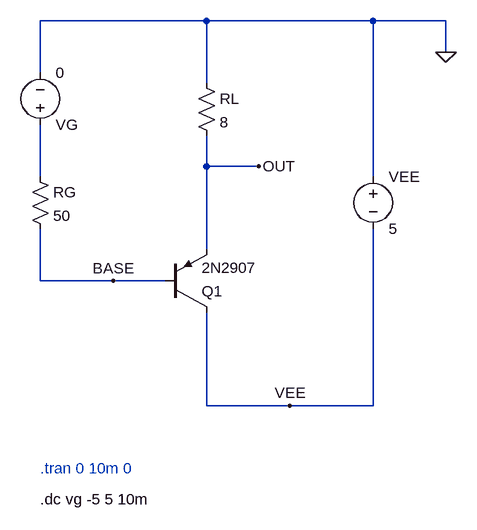
[diagram p0: schematic PNP_Emitter_Follower.asc]
PNP_Emitter_Follower.asc, the LTspice schematic file:
Version 4.1
SHEET 1 1932 1136
WIRE 256 0 0 0
WIRE 512 0 256 0
WIRE 624 0 512 0
WIRE 624 48 624 0
WIRE 0 80 0 0
WIRE 256 96 256 0
WIRE 256 224 256 176
WIRE 336 224 256 224
WIRE 0 240 0 160
WIRE 512 240 512 0
WIRE 256 352 256 224
WIRE 0 400 0 320
WIRE 112 400 0 400
WIRE 192 400 112 400
WIRE 256 592 256 448
WIRE 384 592 256 592
WIRE 512 592 512 320
WIRE 512 592 384 592
FLAG 624 48 0
FLAG 384 592 VEE
FLAG 112 400 BASE
FLAG 336 224 OUT
SYMBOL voltage 512 224 R0
WINDOW 123 0 0 Left 0
WINDOW 39 0 0 Left 0
SYMATTR InstName VEE
SYMATTR Value 5
SYMBOL pnp 192 448 M180
SYMATTR InstName Q1
SYMATTR Value 2N2907
SYMBOL res 240 80 R0
SYMATTR InstName RL
SYMATTR Value 8
SYMBOL voltage 0 176 M180
WINDOW 123 0 0 Left 0
WINDOW 39 0 0 Left 0
SYMATTR InstName VG
SYMATTR Value 0
SYMBOL res -16 224 R0
SYMATTR InstName RG
SYMATTR Value 50
TEXT 0 688 Left 2 ;.tran 0 10m 0
TEXT 0 736 Left 2 !.dc vg -5 5 10m

The netlist it stands for:
* PNP_Emitter_Follower.asc
VEE 0 VEE 5
Q1 VEE BASE OUT 0 2N2907
RL 0 OUT 8
VG N001 0 0
RG N001 BASE 50
.model NPN NPN
.model PNP PNP
.lib standard.bjt
* .tran 0 10m 0
.dc vg -5 5 10m
.backanno
.end